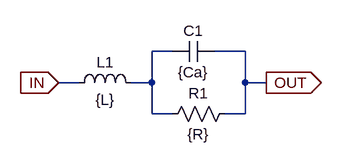
[diagram p0: schematic resistor_highVal.asc]
resistor_highVal.asc, the LTspice schematic file:
Version 4
SHEET 1 880 680
WIRE 224 128 192 128
WIRE 336 128 288 128
WIRE 80 176 48 176
WIRE 192 176 192 128
WIRE 192 176 160 176
WIRE 336 176 336 128
WIRE 368 176 336 176
WIRE 192 224 192 176
WIRE 224 224 192 224
WIRE 336 224 336 176
WIRE 336 224 304 224
FLAG 48 176 IN
IOPIN 48 176 In
FLAG 368 176 OUT
IOPIN 368 176 Out
SYMBOL ind 64 192 R270
WINDOW 0 32 56 VTop 2
WINDOW 3 5 56 VBottom 2
SYMATTR InstName L1
SYMATTR Value {L}
SYMBOL cap 224 144 R270
WINDOW 0 32 32 VTop 2
WINDOW 3 0 32 VBottom 2
SYMATTR InstName C1
SYMATTR Value {Ca}
SYMBOL res 320 208 R90
WINDOW 0 0 56 VBottom 2
WINDOW 3 32 56 VTop 2
SYMATTR InstName R1
SYMATTR Value {R}

The netlist it stands for:
* resistor_highVal.asc
L1 IN N001 {L}
C1 N001 OUT {Ca}
R1 OUT N001 {R}
.backanno
.end